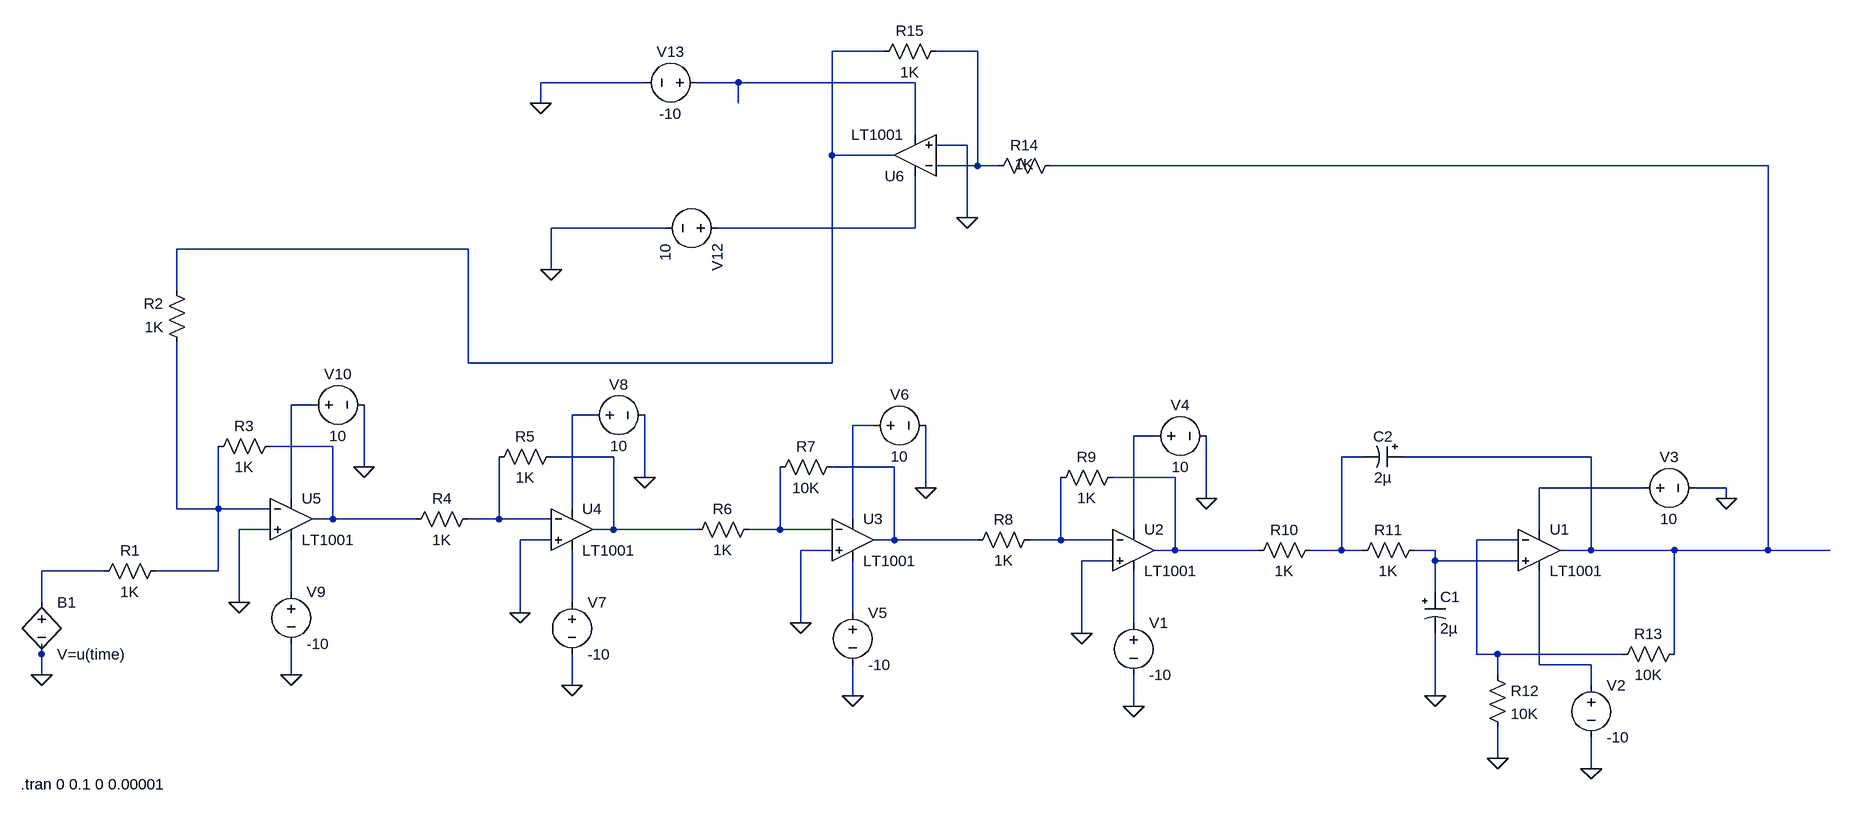
[diagram p0: schematic P_controller.asc]
P_controller.asc, the LTspice schematic file:
Version 4
SHEET 1 1380 680
WIRE -80 -560 -160 -560
WIRE 64 -560 0 -560
WIRE -448 -512 -608 -512
WIRE -304 -512 -368 -512
WIRE -32 -512 -304 -512
WIRE -608 -480 -608 -512
WIRE -304 -480 -304 -512
WIRE -32 -432 -32 -512
WIRE 48 -416 0 -416
WIRE -160 -400 -160 -560
WIRE -64 -400 -160 -400
WIRE 64 -384 64 -560
WIRE 64 -384 0 -384
WIRE 96 -384 64 -384
WIRE 1280 -384 176 -384
WIRE 48 -304 48 -416
WIRE -416 -288 -592 -288
WIRE -32 -288 -32 -368
WIRE -32 -288 -336 -288
WIRE -720 -256 -1168 -256
WIRE -592 -224 -592 -288
WIRE -1168 -192 -1168 -256
WIRE -720 -80 -720 -256
WIRE -160 -80 -160 -400
WIRE -160 -80 -720 -80
WIRE -960 -16 -992 -16
WIRE -528 0 -560 0
WIRE -96 16 -128 16
WIRE 336 32 304 32
WIRE -928 48 -1024 48
WIRE -496 64 -592 64
WIRE 656 64 624 64
WIRE 1008 64 720 64
WIRE -880 80 -880 -16
WIRE -64 80 -160 80
WIRE -448 96 -448 0
WIRE 368 96 272 96
WIRE -16 112 -16 16
WIRE 1088 112 928 112
WIRE 1216 112 1168 112
WIRE -992 128 -992 -16
WIRE 416 128 416 32
WIRE 1216 128 1216 112
WIRE -1168 144 -1168 -112
WIRE -1104 144 -1104 48
WIRE -1104 144 -1168 144
WIRE -1024 144 -1104 144
WIRE -560 144 -560 0
WIRE -928 160 -928 48
WIRE -928 160 -960 160
WIRE -800 160 -928 160
WIRE -672 160 -672 64
WIRE -672 160 -720 160
WIRE -592 160 -672 160
WIRE -128 160 -128 16
WIRE -1024 176 -1072 176
WIRE -496 176 -496 64
WIRE -496 176 -528 176
WIRE -368 176 -496 176
WIRE -240 176 -240 80
WIRE -240 176 -288 176
WIRE -160 176 -240 176
WIRE 304 176 304 32
WIRE 928 176 928 112
WIRE -592 192 -640 192
WIRE -64 192 -64 80
WIRE -64 192 -96 192
WIRE 64 192 -64 192
WIRE 192 192 192 96
WIRE 192 192 144 192
WIRE 272 192 192 192
WIRE 896 192 832 192
WIRE -160 208 -208 208
WIRE 368 208 368 96
WIRE 368 208 336 208
WIRE 496 208 368 208
WIRE 624 208 624 64
WIRE 624 208 576 208
WIRE 656 208 624 208
WIRE 768 208 736 208
WIRE 1008 208 1008 64
WIRE 1008 208 960 208
WIRE 1136 208 1008 208
WIRE 1280 208 1280 -384
WIRE 1280 208 1136 208
WIRE 1376 208 1280 208
WIRE 272 224 224 224
WIRE 768 224 768 208
WIRE 896 224 768 224
WIRE -1280 240 -1376 240
WIRE -1104 240 -1104 144
WIRE -1104 240 -1200 240
WIRE -992 272 -992 192
WIRE 768 272 768 224
WIRE -1376 288 -1376 240
WIRE -1072 288 -1072 176
WIRE -560 288 -560 208
WIRE -640 304 -640 192
WIRE -128 304 -128 224
WIRE -208 320 -208 208
WIRE 304 320 304 240
WIRE 224 336 224 224
WIRE -1376 368 -1376 352
WIRE 832 368 832 192
WIRE 864 368 832 368
WIRE 1056 368 864 368
WIRE 1136 368 1136 208
WIRE 928 384 928 240
WIRE 1008 384 928 384
WIRE -1376 400 -1376 368
WIRE -992 400 -992 352
WIRE 864 400 864 368
WIRE -560 416 -560 368
WIRE 1008 416 1008 384
WIRE -128 432 -128 384
WIRE 768 432 768 336
WIRE 304 448 304 400
WIRE 864 528 864 480
WIRE 1008 544 1008 496
FLAG 864 528 0
FLAG 768 432 0
FLAG 1008 544 0
FLAG 1216 128 0
FLAG 416 128 0
FLAG 304 448 0
FLAG 224 336 0
FLAG -16 112 0
FLAG -128 432 0
FLAG -208 320 0
FLAG -448 96 0
FLAG -560 416 0
FLAG -640 304 0
FLAG -880 80 0
FLAG -992 400 0
FLAG -1072 288 0
FLAG -1376 400 0
FLAG -592 -224 0
FLAG -608 -480 0
FLAG 48 -304 0
SYMBOL voltage 1008 400 R0
WINDOW 123 0 0 Left 0
WINDOW 39 0 0 Left 0
SYMATTR InstName V2
SYMATTR Value -10
SYMBOL voltage 1072 112 R270
WINDOW 0 32 56 VTop 2
WINDOW 3 -32 56 VBottom 2
WINDOW 123 0 0 Left 0
WINDOW 39 0 0 Left 0
SYMATTR InstName V3
SYMATTR Value 10
SYMBOL res 752 192 R90
WINDOW 0 0 56 VBottom 2
WINDOW 3 32 56 VTop 2
SYMATTR InstName R11
SYMATTR Value 1K
SYMBOL polcap 752 272 R0
SYMATTR InstName C1
SYMATTR Value 2µ
SYMBOL polcap 720 48 R90
WINDOW 0 0 32 VBottom 2
WINDOW 3 32 32 VTop 2
SYMATTR InstName C2
SYMATTR Value 2µ
SYMBOL OpAmps\\LT1001 928 144 R0
SYMATTR InstName U1
SYMBOL res 848 384 R0
SYMATTR InstName R12
SYMATTR Value 10K
SYMBOL res 1152 352 R90
WINDOW 0 0 56 VBottom 2
WINDOW 3 32 56 VTop 2
SYMATTR InstName R13
SYMATTR Value 10K
SYMBOL OpAmps\\LT1001 304 144 R0
SYMATTR InstName U2
SYMBOL voltage 304 304 R0
WINDOW 123 0 0 Left 0
WINDOW 39 0 0 Left 0
SYMATTR InstName V1
SYMATTR Value -10
SYMBOL voltage 320 32 R270
WINDOW 0 32 56 VTop 2
WINDOW 3 -32 56 VBottom 2
WINDOW 123 0 0 Left 0
WINDOW 39 0 0 Left 0
SYMATTR InstName V4
SYMATTR Value 10
SYMBOL res 592 192 R90
WINDOW 0 0 56 VBottom 2
WINDOW 3 32 56 VTop 2
SYMATTR InstName R10
SYMATTR Value 1K
SYMBOL res 288 80 R90
WINDOW 0 0 56 VBottom 2
WINDOW 3 32 56 VTop 2
SYMATTR InstName R9
SYMATTR Value 1K
SYMBOL OpAmps\\LT1001 -128 128 R0
SYMATTR InstName U3
SYMBOL voltage -128 288 R0
WINDOW 123 0 0 Left 0
WINDOW 39 0 0 Left 0
SYMATTR InstName V5
SYMATTR Value -10
SYMBOL voltage -112 16 R270
WINDOW 0 32 56 VTop 2
WINDOW 3 -32 56 VBottom 2
WINDOW 123 0 0 Left 0
WINDOW 39 0 0 Left 0
SYMATTR InstName V6
SYMATTR Value 10
SYMBOL res 160 176 R90
WINDOW 0 0 56 VBottom 2
WINDOW 3 32 56 VTop 2
SYMATTR InstName R8
SYMATTR Value 1K
SYMBOL res -144 64 R90
WINDOW 0 0 56 VBottom 2
WINDOW 3 32 56 VTop 2
SYMATTR InstName R7
SYMATTR Value 10K
SYMBOL OpAmps\\LT1001 -560 112 R0
SYMATTR InstName U4
SYMBOL voltage -560 272 R0
WINDOW 123 0 0 Left 0
WINDOW 39 0 0 Left 0
SYMATTR InstName V7
SYMATTR Value -10
SYMBOL voltage -544 0 R270
WINDOW 0 32 56 VTop 2
WINDOW 3 -32 56 VBottom 2
WINDOW 123 0 0 Left 0
WINDOW 39 0 0 Left 0
SYMATTR InstName V8
SYMATTR Value 10
SYMBOL res -272 160 R90
WINDOW 0 0 56 VBottom 2
WINDOW 3 32 56 VTop 2
SYMATTR InstName R6
SYMATTR Value 1K
SYMBOL res -576 48 R90
WINDOW 0 0 56 VBottom 2
WINDOW 3 32 56 VTop 2
SYMATTR InstName R5
SYMATTR Value 1K
SYMBOL OpAmps\\LT1001 -992 96 R0
SYMATTR InstName U5
SYMBOL voltage -992 256 R0
WINDOW 123 0 0 Left 0
WINDOW 39 0 0 Left 0
SYMATTR InstName V9
SYMATTR Value -10
SYMBOL voltage -976 -16 R270
WINDOW 0 32 56 VTop 2
WINDOW 3 -32 56 VBottom 2
WINDOW 123 0 0 Left 0
WINDOW 39 0 0 Left 0
SYMATTR InstName V10
SYMATTR Value 10
SYMBOL res -704 144 R90
WINDOW 0 0 56 VBottom 2
WINDOW 3 32 56 VTop 2
SYMATTR InstName R4
SYMATTR Value 1K
SYMBOL res -1008 32 R90
WINDOW 0 0 56 VBottom 2
WINDOW 3 32 56 VTop 2
SYMATTR InstName R3
SYMATTR Value 1K
SYMBOL res -1152 -96 R180
WINDOW 0 36 76 Left 2
WINDOW 3 36 40 Left 2
SYMATTR InstName R2
SYMATTR Value 1K
SYMBOL res -1184 224 R90
WINDOW 0 0 56 VBottom 2
WINDOW 3 32 56 VTop 2
SYMATTR InstName R1
SYMATTR Value 1K
SYMBOL OpAmps\\LT1001 -32 -336 R180
SYMATTR InstName U6
SYMBOL res 192 -400 R90
WINDOW 0 0 56 VBottom 2
WINDOW 3 -2 56 VTop 2
SYMATTR InstName R14
SYMATTR Value 1K
SYMBOL res 16 -576 R90
WINDOW 0 0 56 VBottom 2
WINDOW 3 32 56 VTop 2
SYMATTR InstName R15
SYMATTR Value 1K
SYMBOL voltage -320 -288 R90
WINDOW 123 0 0 Left 0
WINDOW 39 0 0 Left 0
SYMATTR InstName V12
SYMATTR Value 10
SYMBOL voltage -352 -512 R90
WINDOW 0 -32 56 VBottom 2
WINDOW 3 32 56 VTop 2
WINDOW 123 0 0 Left 0
WINDOW 39 0 0 Left 0
SYMATTR InstName V13
SYMATTR Value -10
SYMBOL bv -1376 272 R0
SYMATTR InstName B1
SYMATTR Value V=u(time)
TEXT -1408 568 Left 2 !.tran 0 0.1 0 0.00001

The netlist it stands for:
* P_controller.asc
V2 N027 0 -10
V3 N015 0 10
R11 N021 N012 1K
C1 N021 0 2µ
C2 N004 N012 2µ
XU1 N021 N020 N015 N027 N004 LT1001  ; pins In+ In- V+ V- OUT
R12 N020 0 10K
R13 N004 N020 10K
XU2 0 N019 N009 N026 N014 LT1001  ; pins In+ In- V+ V- OUT
V1 N026 0 -10
V4 N009 0 10
R10 N012 N014 1K
R9 N014 N019 1K
XU3 0 N018 N008 N025 N013 LT1001  ; pins In+ In- V+ V- OUT
V5 N025 0 -10
V6 N008 0 10
R8 N019 N013 1K
R7 N013 N018 10K
XU4 0 N017 N007 N024 N011 LT1001  ; pins In+ In- V+ V- OUT
V7 N024 0 -10
V8 N007 0 10
R6 N018 N011 1K
R5 N011 N017 1K
XU5 0 N016 N006 N023 N010 LT1001  ; pins In+ In- V+ V- OUT
V9 N023 0 -10
V10 N006 0 10
R4 N017 N010 1K
R3 N010 N016 1K
R2 N016 N001 1K
R1 N016 N022 1K
XU6 0 N002 N005 N003 N001 LT1001  ; pins In+ In- V+ V- OUT
R14 N004 N002 1K
R15 N002 N001 1K
V12 N005 0 10
V13 N003 0 -10
B1 N022 0 V=u(time)
.tran 0 0.1 0 0.00001
.lib LTC.lib
.backanno
.end